# EAGLE board control (EAGLE 9.6.2)
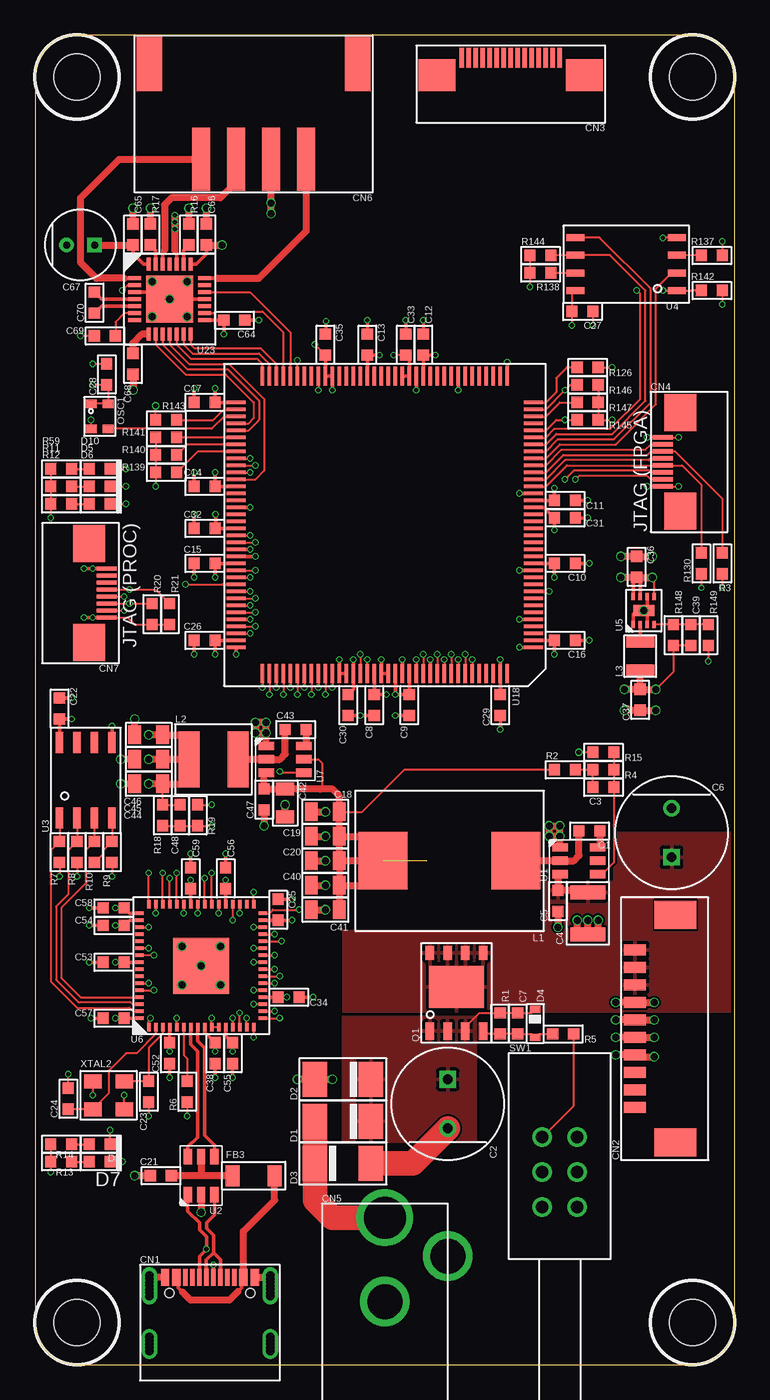
[diagram p5: board, top side]
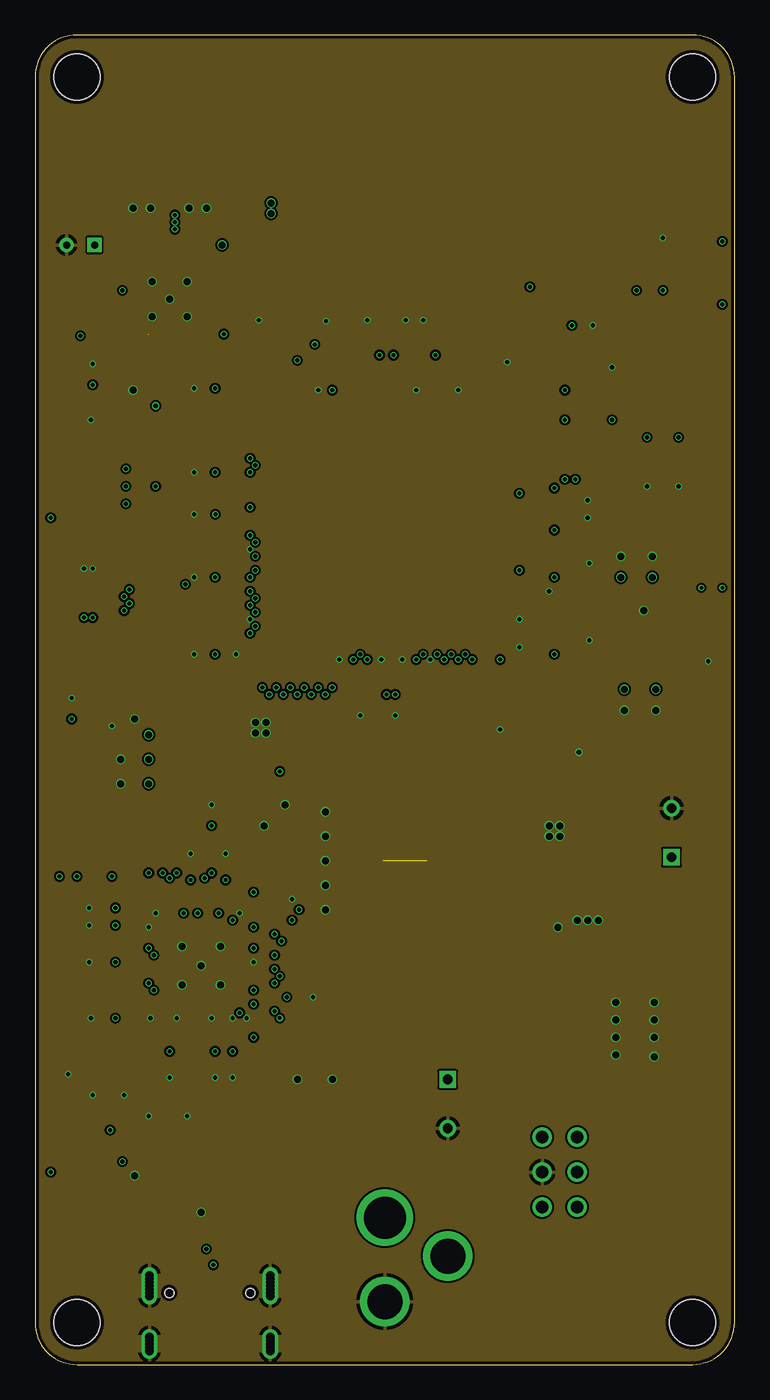
[diagram p6: board, inner layer GND]
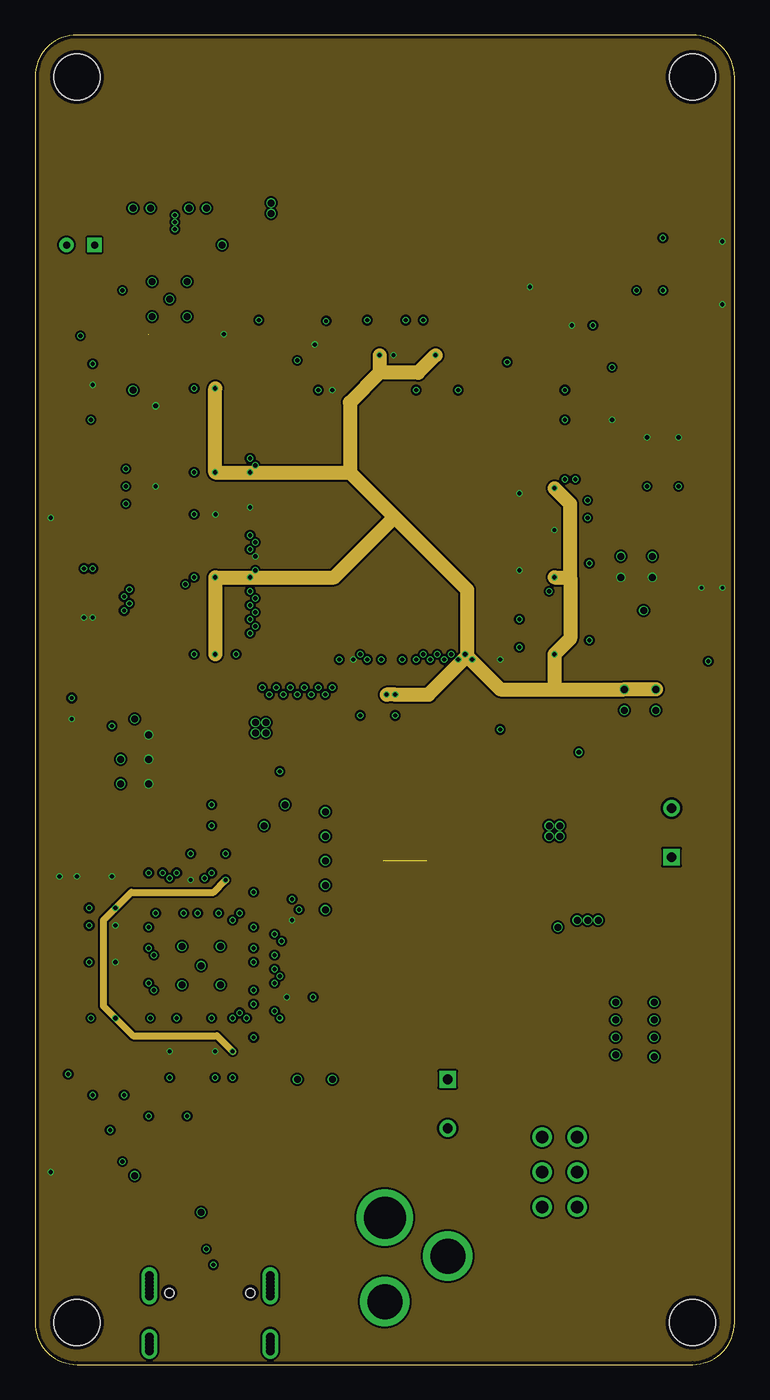
[diagram p7: board, inner layer PWR]
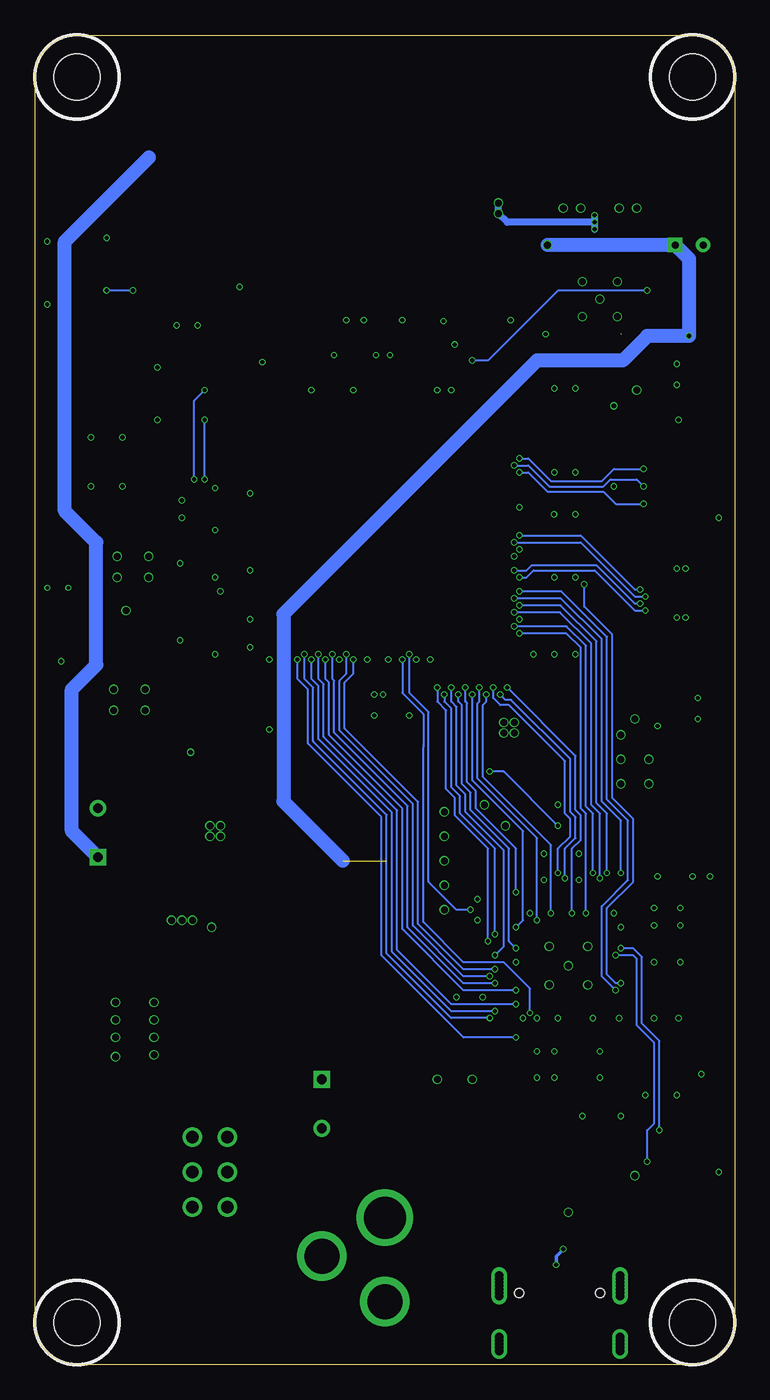
[diagram p8: board, bottom side, seen from below]

Size 50 x 95 mm. Coordinates in mm from the lower left corner, seen from the top.
Outline: 0,92 0,3 arc90 3,0 47,0 arc90 50,3 50,92 arc90 47,95 3,95 arc90 0,92
Copper layers (1*2*3*16): Top 0.035mm / dielectric 0.15mm / GND 0.035mm / dielectric 1.11mm / PWR 0.035mm / dielectric 0.2mm / Bottom 0.035mm
Design rules "myDRC 4 layers 0.15mm": minimum track width 0.15mm, minimum drill 0.25mm, track to track 0.15mm, track to pad 0.15mm, pad to pad 0.15mm, via to via 0.15mm, smd to smd 0mil, copper to edge 0.25mm, drill to drill 0.25mm, minimum pad ring 10mil, minimum via ring 3mil, stop-mask expansion 4mil, vias tented up to drill 1mm, thermal gap 10mil

## Footprints (pad centres in the part's own frame; a part is rotated, then mirrored left to right if it is on the bottom)
0603 = smd 0.8 x 0.8: 1 -0.75,0; 2 0.75,0
8MM_RADIAL_3.5MM_PITCH = drill 0.7: N 1.75,0 | drill 0.7 square: P -1.75,0
1210 = smd 1 x 2.5: 1 -1.5,0; 2 1.5,0
0805 = smd 0.9 x 1.3: 1 -1,0; 2 1,0
5MM_RADIAL_2MM_PITCH = drill 0.5 square: 1 -1,0 | drill 0.5: 2 1,0
MC-107D = smd 0.3 x 1.2: A5 -1.25,3.225; A6 -0.25,3.225; A7 0.25,3.225; A8 1.25,3.225; B5 1.75,3.225; B6 0.75,3.225; B7 -0.75,3.225; B8 -1.75,3.225 | smd 0.6 x 1.2: A9B4 2.4,3.225; A12B1 3.2,3.225; B9A4 -2.4,3.225; B12A1 -3.2,3.225 | drill 0.6 pad 1: P$1 -4.32,2.625; P$2 -4.32,2.875; P$3 -4.32,3.125; P$4 -4.32,3.375; P$5 -4.32,2.375; P$6 -4.32,2.125; P$7 -4.32,1.875; P$8 4.32,2.625; P$9 4.32,2.875; P$10 4.32,3.125; P$11 4.32,3.375; P$12 4.32,2.375; P$13 4.32,2.125; P$14 4.32,1.875; P$15 -4.32,-1.525; P$16 -4.32,-1.275; P$17 -4.32,-1.025; P$18 -4.32,-1.775; P$19 -4.32,-2.025; P$20 4.32,-1.525; P$21 4.32,-1.275; P$22 4.32,-1.025; P$23 4.32,-1.775; P$24 4.32,-2.025 | hole 0.65: -2.9,2.125; 2.9,2.125
1.25-10PWT = smd 0.8 x 1.6: 1 -5.625,2.125; 2 -4.375,2.125; 3 -3.125,2.125; 4 -1.875,2.125; 5 -0.625,2.125; 6 0.625,2.125; 7 1.875,2.125; 8 3.125,2.125; 9 4.375,2.125; 10 5.625,2.125 | smd 2 x 3: PAD1 -8.125,-0.775; PAD2 8.125,-0.775
SFV15R-1STE1HLF = smd 0.3 x 1.4: 1 -3.5,-1.875; 2 -3,-1.875; 3 -2.5,-1.875; 4 -2,-1.875; 5 -1.5,-1.875; 6 -1,-1.875; 7 -0.5,-1.875; 8 0,-1.875; 9 0.5,-1.875; 10 1,-1.875; 11 1.5,-1.875; 12 2,-1.875; 13 2.5,-1.875; 14 3,-1.875; 15 3.5,-1.875 | smd 2.65 x 2.3: SH1 -5.275,-0.625; SH2 5.275,-0.625
SFV8R-1STBE1HLF = smd 0.3 x 1.4: 1 -1.75,-1.875; 2 -1.25,-1.875; 3 -0.75,-1.875; 4 -0.25,-1.875; 5 0.25,-1.875; 6 0.75,-1.875; 7 1.25,-1.875; 8 1.75,-1.875 | smd 2.65 x 2.3: SH1 -3.525,-0.625; SH2 3.525,-0.625
NEB-21-R = drill 3: 1 0,6.5 | drill 2.5: 2 4.5,3.75; 3 0,0.5
S4B-XH-SM4-TB = smd 1.3 x 4.5: 1 3.75,-3.25; 2 1.25,-3.25; 3 -1.25,-3.25; 4 -3.75,-3.25 | smd 1.8 x 3.9: P$1 -7.45,3.55; P$2 7.45,3.55
DO214AC = smd 1.75 x 2.5: A -2,0; K 2,0
SOD_523 = smd 0.5 x 0.75: A -1,0; K 1,0
0603_POLAR = smd 0.8 x 0.8: A 0.75,0; K -0.75,0
1206 = smd 1 x 1.5: 1 1.5,0; 2 -1.5,0
SRP1035A = smd 3.5 x 4.1: 1 -4.75,0; 2 4.75,0
SRN5040 = smd 4 x 1.5: 1 0,1.75; 2 0,-1.75
1008 = smd 0.8 x 2: 1 1,0; 2 -1,0
MOUNTHOLE_6X3 = hole 3.3: 0,0
KC2016Z = smd 0.6 x 0.8: 1 -0.9,-0.6; 2 0.9,-0.6; 3 0.9,0.6; 4 -0.9,0.6
SO8_POWERPAK = smd 1.25 x 0.6: 1 -2.67,1.905; 2 -2.67,0.635; 3 -2.67,-0.635; 4 -2.67,-1.905 | smd 1 x 0.6: 5 2.92,0.635; 6 2.92,-0.635; 7 2.92,-1.905; 8 2.92,1.905 | smd 3 x 3.9: PAD 0.5,0
PBH2UEESNPNAGX = drill 0.9: 1 -1.25,-2.5; 2 -1.25,0; 3 -1.25,2.5; 4 1.25,-2.5; 5 1.25,0; 6 1.25,2.5
SOT23-6 = smd 0.6 x 1.1: 1 0.95,1.35; 2 0,1.35; 3 -0.95,1.35; 4 -0.95,-1.35; 5 0,-1.35; 6 0.95,-1.35
SO8 = smd 1.5 x 0.55: 1 -2.7,1.875; 2 -2.7,0.625; 3 -2.7,-0.625; 4 -2.7,-1.875; 5 2.7,-1.875; 6 2.7,-0.625; 7 2.7,0.625; 8 2.7,1.875
SO8-208MIL = smd 1.3 x 0.5: 1 -3.625,1.905; 2 -3.625,0.635; 3 -3.625,-0.635; 4 -3.625,-1.905; 5 3.625,-1.905; 6 3.625,-0.635; 7 3.625,0.635; 8 3.625,1.905
WSON8 = smd 0.5 x 0.25: 1 -1,0.75; 2 -1,0.25; 3 -1,-0.25; 4 -1,-0.75; 5 1,-0.75; 6 1,-0.25; 7 1,0.25; 8 1,0.75 | smd 0.8 x 1.5: PAD 0,0
QFN64 = smd 0.6 x 0.25: 1 -4.4,3.75; 2 -4.4,3.25; 3 -4.4,2.75; 4 -4.4,2.25; 5 -4.4,1.75; 6 -4.4,1.25; 7 -4.4,0.75; 8 -4.4,0.25; 9 -4.4,-0.25; 10 -4.4,-0.75; 11 -4.4,-1.25; 12 -4.4,-1.75; 13 -4.4,-2.25; 14 -4.4,-2.75; 15 -4.4,-3.25; 16 -4.4,-3.75; 33 4.4,-3.75; 34 4.4,-3.25; 35 4.4,-2.75; 36 4.4,-2.25; 37 4.4,-1.75; 38 4.4,-1.25; 39 4.4,-0.75; 40 4.4,-0.25; 41 4.4,0.25; 42 4.4,0.75; 43 4.4,1.25; 44 4.4,1.75; 45 4.4,2.25; 46 4.4,2.75; 47 4.4,3.25; 48 4.4,3.75 | smd 0.25 x 0.6: 17 -3.75,-4.4; 18 -3.25,-4.4; 19 -2.75,-4.4; 20 -2.25,-4.4; 21 -1.75,-4.4; 22 -1.25,-4.4; 23 -0.75,-4.4; 24 -0.25,-4.4; 25 0.25,-4.4; 26 0.75,-4.4; 27 1.25,-4.4; 28 1.75,-4.4; 29 2.25,-4.4; 30 2.75,-4.4; 31 3.25,-4.4; 32 3.75,-4.4; 49 3.75,4.4; 50 3.25,4.4; 51 2.75,4.4; 52 2.25,4.4; 53 1.75,4.4; 54 1.25,4.4; 55 0.75,4.4; 56 0.25,4.4; 57 -0.25,4.4; 58 -0.75,4.4; 59 -1.25,4.4; 60 -1.75,4.4; 61 -2.25,4.4; 62 -2.75,4.4; 63 -3.25,4.4; 64 -3.75,4.4 | smd 4 x 4: PAD 0,0
QFP144 = smd 1.35 x 0.25: 1 -10.625,8.75; 2 -10.625,8.25; 3 -10.625,7.75; 4 -10.625,7.25; 5 -10.625,6.75; 6 -10.625,6.25; 7 -10.625,5.75; 8 -10.625,5.25; 9 -10.625,4.75; 10 -10.625,4.25; 11 -10.625,3.75; 12 -10.625,3.25; 13 -10.625,2.75; 14 -10.625,2.25; 15 -10.625,1.75; 16 -10.625,1.25; 17 -10.625,0.75; 18 -10.625,0.25; 19 -10.625,-0.25; 20 -10.625,-0.75; 21 -10.625,-1.25; 22 -10.625,-1.75; 23 -10.625,-2.25; 24 -10.625,-2.75; 25 -10.625,-3.25; 26 -10.625,-3.75; 27 -10.625,-4.25; 28 -10.625,-4.75; 29 -10.625,-5.25; 30 -10.625,-5.75; 31 -10.625,-6.25; 32 -10.625,-6.75; 33 -10.625,-7.25; 34 -10.625,-7.75; 35 -10.625,-8.25; 36 -10.625,-8.75; 73 10.625,-8.75; 74 10.625,-8.25; 75 10.625,-7.75; 76 10.625,-7.25; 77 10.625,-6.75; 78 10.625,-6.25; 79 10.625,-5.75; 80 10.625,-5.25; 81 10.625,-4.75; 82 10.625,-4.25; 83 10.625,-3.75; 84 10.625,-3.25; 85 10.625,-2.75; 86 10.625,-2.25; 87 10.625,-1.75; 88 10.625,-1.25; 89 10.625,-0.75; 90 10.625,-0.25; 91 10.625,0.25; 92 10.625,0.75; 93 10.625,1.25; 94 10.625,1.75; 95 10.625,2.25; 96 10.625,2.75; 97 10.625,3.25; 98 10.625,3.75; 99 10.625,4.25; 100 10.625,4.75; 101 10.625,5.25; 102 10.625,5.75; 103 10.625,6.25; 104 10.625,6.75; 105 10.625,7.25; 106 10.625,7.75; 107 10.625,8.25; 108 10.625,8.75 | smd 0.25 x 1.35: 37 -8.75,-10.625; 38 -8.25,-10.625; 39 -7.75,-10.625; 40 -7.25,-10.625; 41 -6.75,-10.625; 42 -6.25,-10.625; 43 -5.75,-10.625; 44 -5.25,-10.625; 45 -4.75,-10.625; 46 -4.25,-10.625; 47 -3.75,-10.625; 48 -3.25,-10.625; 49 -2.75,-10.625; 50 -2.25,-10.625; 51 -1.75,-10.625; 52 -1.25,-10.625; 53 -0.75,-10.625; 54 -0.25,-10.625; 55 0.25,-10.625; 56 0.75,-10.625; 57 1.25,-10.625; 58 1.75,-10.625; 59 2.25,-10.625; 60 2.75,-10.625; 61 3.25,-10.625; 62 3.75,-10.625; 63 4.25,-10.625; 64 4.75,-10.625; 65 5.25,-10.625; 66 5.75,-10.625; 67 6.25,-10.625; 68 6.75,-10.625; 69 7.25,-10.625; 70 7.75,-10.625; 71 8.25,-10.625; 72 8.75,-10.625; 109 8.75,10.625; 110 8.25,10.625; 111 7.75,10.625; 112 7.25,10.625; 113 6.75,10.625; 114 6.25,10.625; 115 5.75,10.625; 116 5.25,10.625; 117 4.75,10.625; 118 4.25,10.625; 119 3.75,10.625; 120 3.25,10.625; 121 2.75,10.625; 122 2.25,10.625; 123 1.75,10.625; 124 1.25,10.625; 125 0.75,10.625; 126 0.25,10.625; 127 -0.25,10.625; 128 -0.75,10.625; 129 -1.25,10.625; 130 -1.75,10.625; 131 -2.25,10.625; 132 -2.75,10.625; 133 -3.25,10.625; 134 -3.75,10.625; 135 -4.25,10.625; 136 -4.75,10.625; 137 -5.25,10.625; 138 -5.75,10.625; 139 -6.25,10.625; 140 -6.75,10.625; 141 -7.25,10.625; 142 -7.75,10.625; 143 -8.25,10.625; 144 -8.75,10.625
QFN28 = smd 0.95 x 0.3: 1 -2.5,1.5; 2 -2.5,1; 3 -2.5,0.5; 4 -2.5,0; 5 -2.5,-0.5; 6 -2.5,-1; 7 -2.5,-1.5; 15 2.5,-1.5; 16 2.5,-1; 17 2.5,-0.5; 18 2.5,0; 19 2.5,0.5; 20 2.5,1; 21 2.5,1.5 | smd 0.3 x 0.95: 8 -1.5,-2.5; 9 -1,-2.5; 10 -0.5,-2.5; 11 0,-2.5; 12 0.5,-2.5; 13 1,-2.5; 14 1.5,-2.5; 22 1.5,2.5; 23 1,2.5; 24 0.5,2.5; 25 0,2.5; 26 -0.5,2.5; 27 -1,2.5; 28 -1.5,2.5 | smd 3.35 x 3.35: 29 0,0
3.2X3.5SMD = smd 1.25 x 1: 1 -1.125,-1; 2 1.125,-1; 3 1.125,1; 4 -1.125,1

## Placement (x,y rotation side)
C1  100nF 16V  [0603]  39.62,38.12 180 top
C2  100uF 50V  [8MM_RADIAL_3.5MM_PITCH]  29.5,18.62 270 top
C3  100pF 50V  [0603]  40.62,41.25 180 top
C4  10uF 50V  [1210]  39.5,32.25 90 top
C5  0.1uF 50V  [0603]  37.38,33.12 90 top
C6  100uF 50V  [8MM_RADIAL_3.5MM_PITCH]  45.5,38 90 top
C7  100pF 50V  [0603]  34.5,24.38 270 top
C8  100nF 16V  [0603]  24.25,47.12 90 top
C9  100nF 16V  [0603]  26.75,47.12 90 top
C10  100nF 16V  [0603]  37.88,57.25 180 top
C11  100nF 16V  [0603]  37.88,61.75 180 top
C12  100nF 16V  [0603]  27.75,72.88 270 top
C13  100nF 16V  [0603]  23.75,72.88 270 top
C14  100nF 16V  [0603]  12.12,62.75 0 top
C15  100nF 16V  [0603]  12.12,57.25 0 top
C16  100nF 16V  [0603]  37.88,51.75 180 top
C17  100nF 16V  [0603]  12.12,68.75 0 top
C18  10uF 50V  [0805]  20.75,39.5 0 top
C19  10uF 50V  [0805]  20.75,37.75 0 top
C20  10uF 50V  [0805]  20.75,36 0 top
C21  0.1uF 16V  [0603]  9,13.5 0 top
C22  0.1uF 16V  [0603]  1.75,46.88 270 top
C23  10pF 100V  [0603]  8.12,19.5 90 top
C24  10pF 100V  [0603]  2.38,19 270 top
C25  0.1uF 16V  [0603]  17.38,32.5 270 top
C26  100nF 16V  [0603]  12.12,51.75 0 top
C27  100nF 16V  [0603]  39.12,75.25 180 top
C28  100nF 16V  [0603]  5.12,70.75 90 top
C29  100nF 16V  [0603]  33.25,47.12 90 top
C30  100nF 16V  [0603]  22.38,47.12 90 top
C31  100nF 16V  [0603]  37.88,60.5 180 top
C32  100nF 16V  [0603]  12.12,59.75 0 top
C33  100nF 16V  [0603]  26.5,72.88 270 top
C34  0.1uF 16V  [0603]  18.12,26.25 180 top
C35  100nF 16V  [0603]  20.75,72.88 270 top
C36  10uF 6.3V  [0603]  43,57 270 top
C37  10uF 6.3V  [0603]  43.25,47.5 90 top
C38  0.1uF 16V  [0603]  12.88,22.25 90 top
C39  33pF 10V  [0603]  46.88,52.12 270 top
C40  10uF 50V  [0805]  20.75,34.25 0 top
C41  10uF 50V  [0805]  20.75,32.5 0 top
C42  10uF 50V  [0805]  17.88,40.12 90 top
C43  100nF 16V  [0603]  18.62,45.38 180 top
C44  10uF 50V  [0805]  8.12,45 0 top
C45  10uF 50V  [0805]  8.12,43.25 0 top
C46  10uF 50V  [0805]  8.12,41.5 0 top
C47  0.1uF 50V  [0603]  16.38,40.38 90 top
C48  NO FIT  [0603]  10.38,39.25 90 top
C52  0.1uF 16V  [0603]  9.62,22.25 90 top
C53  0.1uF 16V  [0603]  5.62,28.75 0 top
C54  0.1uF 16V  [0603]  5.62,31.38 0 top
C55  0.1uF 16V  [0603]  14.12,22.25 90 top
C56  0.1uF 16V  [0603]  13.62,34.75 270 top
C57  0.1uF 16V  [0603]  5.62,24.75 0 top
C58  4.7uF 6.3V  [0603]  5.62,32.62 0 top
C59  0.1uF 16V  [0603]  11.12,34.75 270 top
C64  100nF 16V  [0603]  14.25,74.62 180 top
C65  100nF 16V  [0603]  7,80.75 270 top
C66  100nF 16V  [0603]  12.25,80.75 270 top
C67  100uF 25V  [5MM_RADIAL_2MM_PITCH]  3.25,80 180 top
C68  2.2uF 10V  [0603]  7,71.5 90 top
C69  100nF 16V  [0603]  5,73.5 180 top
C70  0.022uF 50V  [0603]  4.25,75.88 270 top
CN1  USB C 2.0  [MC-107D]  12.5,3 0 top
CN2  JST GH 10 Pin  [1.25-10PWT]  45,24 90 top
CN3  15PIN 0.5MM  [SFV15R-1STE1HLF]  34,91.5 180 top
CN4  8 PIN FFC  [SFV8R-1STBE1HLF]  46.75,64.5 270 top
CN5  NEB-21-R  [NEB-21-R]  25,4 0 top
CN6  S4B-XH-SM4-TB  [S4B-XH-SM4-TB]  15.62,89.38 0 top
CN7  8 PIN FFC  [SFV8R-1STBE1HLF]  3.25,55.12 90 top
D1  B360A-13-F  [DO214AC]  22,17.38 0 top
D2  B360A-13-F  [DO214AC]  22,20.38 0 top
D3  12V BI TVS  [DO214AC]  22,14.38 180 top
D4  BZX585-C10  [SOD_523]  35.75,24.38 90 top
D5  RED LED  [0603_POLAR]  4.62,62.75 180 top
D6  RED LED  [0603_POLAR]  4.62,61.5 180 top
D7  RED LED  [0603_POLAR]  4.62,14.5 180 top
D8  RED LED  [0603_POLAR]  4.62,15.75 180 top
D10  RED LED  [0603_POLAR]  4.62,64 180 top
FB3  150R 100MHz  [1206]  15.62,13.5 0 top
L1  15uH 6.5A  [SRP1035A]  29.62,36 180 top
L2  2.2uH 3.5A  [SRN5040]  12.75,43.25 270 top
L3  1uH  [1008]  43.25,50.62 90 top
MECH1  6mm x 3mm  [MOUNTHOLE_6X3]  3,3 0 top
MECH2  6mm x 3mm  [MOUNTHOLE_6X3]  47,3 180 bottom
MECH3  6mm x 3mm  [MOUNTHOLE_6X3]  3,92 0 top
MECH4  6mm x 3mm  [MOUNTHOLE_6X3]  47,92 0 top
OSC1  33MHz  [KC2016Z]  4.62,67.75 270 top
Q1  GSFP0449  [SO8_POWERPAK]  30.12,26.5 90 top
R1  10k  [0603]  33.25,24.38 270 top
R2  51k  [0603]  37.88,42.5 180 top
R3  10k  [0603]  49.12,57.25 270 top
R4  100k  [0603]  40.62,42.5 180 top
R5  10k  [0603]  37.75,23.62 180 top
R6  12k  [0603]  10.88,19.5 90 top
R7  10k  [0603]  1.75,36.62 270 top
R8  10k  [0603]  3,36.62 270 top
R9  10k  [0603]  5.5,36.62 270 top
R10  2.2k  [0603]  4.25,36.62 90 top
R11  2.2k  [0603]  1.88,62.75 180 top
R12  2.2k  [0603]  1.88,61.5 180 top
R13  2.2k  [0603]  1.88,14.5 180 top
R14  2.2k  [0603]  1.88,15.75 180 top
R15  5.23k  [0603]  40.62,43.75 0 top
R16  0.33R  [0603]  11,80.75 90 top
R17  0.33R  [0603]  8.25,80.75 90 top
R18  34k  [0603]  9.12,39.25 90 top
R19  10k  [0603]  11.62,39.25 270 top
R20  10k  [0603]  8.38,53.62 270 top
R21  10k  [0603]  9.62,53.62 270 top
R59  2.2k  [0603]  1.88,64 180 top
R126  10k  [0603]  39.5,71.25 180 top
R130  10k  [0603]  47.62,57.25 270 top
R137  10k  [0603]  48.38,79.25 0 top
R138  10k  [0603]  36.12,78 180 top
R139  10k  [0603]  9.38,63.75 180 top
R140  10k  [0603]  9.38,65 180 top
R141  10k  [0603]  9.38,66.25 180 top
R142  10k  [0603]  48.38,76.75 0 top
R143  10k  [0603]  9.38,67.5 180 top
R144  10k  [0603]  36.12,79.25 180 top
R145  10k  [0603]  39.5,67.5 0 top
R146  10k  [0603]  39.5,70 0 top
R147  10k  [0603]  39.5,68.75 0 top
R148  180k  [0603]  45.62,52.12 270 top
R149  180k  [0603]  48.12,52.12 90 top
SW1  DPDT  [PBH2UEESNPNAGX]  37.5,13.75 0 top
U1  TPS54302  [SOT23-6]  38.88,36 90 top
U2  USBLC6-2SC6  [SOT23-6]  11.88,13.5 180 top
U3  93LC56B-I/SN  [SO8]  3.62,41.75 90 top
U4  W25Q128JV  [SO8-208MIL]  42.25,78.62 180 top
U5  TPS62065  [WSON8]  43.5,53.88 90 top
U6  FT2232H  [QFN64]  11.88,28.5 90 top
U7  TPS563201  [SOT23-6]  17.88,43.25 90 top
U18  T8Q144C4  [QFP144]  25,60 180 top
U23  TMC2208-LA-T  [QFN28]  9.62,76.12 0 top
XTAL2  12MHz  [3.2X3.5SMD]  5.25,19.25 0 top

## Tracks (layer width: path | path; a pad name or v marks a point on that pad's centre or on a via)
FLS_NHOLD
  Top 0.15: R138.1 38.61,77.98 U4.7
FLS_SPI_CLK
  Top 0.15: U4.6 38.61,79.27 38.5,79.27 | 38.5,79.27 R144.1 | U18.30 36.5,65.75 37.25,66.5 41.25,66.5 43.62,68.88 43.62,76.75 41.1,79.27 38.5,79.27
FLS_SPI_MISO
  Top 0.15: U18.28 36.5,64.75 37.5,65.75 41.5,65.75 44.38,68.62 44.38,76.88 45.49,77.99 U4.2
FLS_SPI_MOSI
  Top 0.15: U18.29 36.5,65.25 37.38,66.12 41.38,66.12 44,68.75 44,76.88 40.34,80.53 U4.5
FLS_SPI_NCS  (via drill 0.3)
  Top 0.15: R142.1 46.88,76.72 46,76.72 | U4.1 46,76.72 | U18.31 36.5,66.25 37.12,66.88 41.12,66.88 43.25,69 43.25,76.49 v42.99,76.74 | v44.88,76.74 45.98,76.74 46,76.72
  Bottom 0.15: v42.99,76.74 v44.88,76.74
FPGA_CLK_33M
  Top 0.15: OSC1.3 5.25,66.88 12.62,66.88 13.5,67.75 U18.75
FPGA_CONF_CBUS_0
  Top 0.15: U18.78 R141.1
FPGA_CONF_CBUS_1
  Top 0.15: U18.79 10.88,65.75 R140.1
FPGA_CONF_CBUS_2
  Top 0.15: U18.80 11.62,65.25 R139.1
FPGA_CONF_CDONE
  Top 0.15: U18.34 36.5,67.75 37.5,68.75 R147.1
FPGA_CONF_CSI  (via drill 0.3)
  Top 0.15: U18.32 36.5,66.75 37.25,67.5 v37.88,67.5 R145.1 | CN4.6 44,63.75 43.88,63.88 38.5,63.88 v37.88,63.25
  Bottom 0.15: v37.88,63.25 v37.88,67.5
FPGA_CONF_NCRST  (via drill 0.3)
  Top 0.15: U18.35 36.5,68.25 v37.88,69.62 38.25,70 R146.1 | CN4.7 44,63.25 43.75,63.5 38.88,63.5 v38.62,63.25
  Bottom 0.15: v38.62,63.25 38.62,68.88 v37.88,69.62
FPGA_CONF_NTEST
  Top 0.15: R143.1 12.74,67.5 13.49,68.25 U18.74
FPGA_JTAG_TCK
  Top 0.15: 45.75,65.25 CN4.3 44,65.25 43.75,65 37.75,65 36.5,63.75 U18.26
  Top 0.152: 45.75,65.25 49.12,61.88 R3.1
FPGA_JTAG_TDI
  Top 0.15: U18.27 36.5,64.25 37.62,65.38 43.62,65.38 44,65.75 CN4.2
FPGA_JTAG_TDO
  Top 0.15: 46.25,64.25 CN4.5 38,64.25 36.5,62.75 U18.24
  Top 0.152: 46.25,64.25 47.62,62.88 R130.1
FPGA_JTAG_TMS
  Top 0.15: U18.25 36.5,63.25 37.88,64.62 43.88,64.62 44,64.75 CN4.4
FPGA_STATUS  (via drill 0.3)
  Top 0.15: U18.83 v15.38,63.75 | D6.K v6.5,61.5
  Bottom 0.15: v15.38,63.75 14.75,63.75 13.38,62.38 9.38,62.38 8.5,61.5 v6.5,61.5
FT_CLKOUT  (via drill 0.3)
  Top 0.15: U6.32 16.75,32.25 17,32.5 v18.88,32.5 | v23.25,50.75 U18.123
  Bottom 0.15: v18.88,32.5 19.88,32.5 21.88,34.5 21.88,46.62 23.25,48 v23.25,50.75
FT_CONT_NCTS  (via drill 0.3)
  Top 0.15: U6.41 v11.62,32.25 | U18.109 v16.25,48.38
  Bottom 0.15: v11.62,32.25 11.62,36.88 11,37.5 11,39.25 11.38,39.62 11.38,43.5 v16.25,48.38
FT_CONT_NDCD  (via drill 0.3)
  Top 0.15: U6.45 v9.62,34.75 | U18.103 v15.75,53.75
  Bottom 0.15: v9.62,34.75 9.62,39.38 10.25,40 10.25,51.53 12.47,53.75 v15.75,53.75
FT_CONT_NDSR  (via drill 0.3)
  Top 0.15: U6.44 v10.12,35.12 | U18.105 v15.75,52.75
  Bottom 0.15: v10.12,35.12 10.12,39.38 10.62,39.88 10.62,51.37 12,52.75 v15.75,52.75
FT_CONT_NDTR  (via drill 0.3)
  Top 0.15: U6.43 v10.62,32.25 | U18.106 v15.38,52.25
  Bottom 0.15: v10.62,32.25 10.62,39.38 11,39.75 11,51.22 12.03,52.25 v15.38,52.25
FT_CONT_NRI  (via drill 0.3)
  Top 0.15: U6.46 v9.12,35.12 | U18.102 v15.38,54.25
  Bottom 0.15: v9.12,35.12 9.12,39.38 9.88,40.12 9.88,51.68 12.44,54.25 v15.38,54.25
FT_CONT_NRTS  (via drill 0.3)
  Top 0.15: U6.40 v12.12,34.75 | U18.110 v16.75,47.88
  Bottom 0.15: v12.12,34.75 12.12,36.88 11.38,37.62 11.38,39.12 11.75,39.5 11.75,43.28 15.97,47.5 16.38,47.5 v16.75,47.88
FT_CONT_NRXLED  (via drill 0.3)
  Top 0.15: D8.K v5.38,16.75 | v8.12,29.75 U6.54
  Bottom 0.15: v5.38,16.75 5.38,23.12 6.62,24.38 6.62,29.12 7.25,29.75 v8.12,29.75
FT_CONT_NTXLED  (via drill 0.3)
  Top 0.15: D7.K v6.25,14.5 | v8.5,29.25 U6.55
  Bottom 0.15: v6.25,14.5 6.25,16.75 5.75,17.25 5.75,23 7,24.25 7,29 7.25,29.25 v8.5,29.25
FT_CONT_PWRSAV  (via drill 0.3)
  Top 0.15: U6.59 v8.12,27.25 | v10.75,55.75 13.38,55.75 13.47,55.75 U18.99
  Bottom 0.15: v8.12,27.25 8.5,27.25 9.12,27.88 9.12,32.62 7.25,34.5 7.25,39 8.75,40.5 8.75,52.15 10.75,54.15 v10.75,55.75
FT_CONT_RX  (via drill 0.3)
  Top 0.15: U6.39 v12.62,35.12 | U18.111 v17.25,48.38
  Bottom 0.15: v12.62,35.12 12.62,36.88 11.75,37.75 11.75,39 12.12,39.38 12.12,43.12 16.12,47.12 16.75,47.12 17.25,47.62 v17.25,48.38
FT_CONT_TX  (via drill 0.3)
  Top 0.15: U6.38 v13.12,32.25 | U18.112 v17.75,47.88
  Bottom 0.15: v13.12,32.25 13.12,37.12 18,42 18,47.12 17.75,47.38 v17.75,47.88
FT_CONT_TXDEN  (via drill 0.3)
  Top 0.15: U6.48 v8.12,35.12 | U18.101 v15.75,54.75
  Bottom 0.15: v8.12,35.12 8.12,38.88 9.5,40.25 9.5,51.84 12.41,54.75 v15.75,54.75
FT_D0  (via drill 0.3)
  Top 0.15: U6.16 v15.62,23.38 | v31.25,50.38 U18.139
  Bottom 0.15: v15.62,23.38 19.38,23.38 25.25,29.25 25.25,39.12 30.5,44.38 30.5,48.25 31.25,49 v31.25,50.38
FT_D1  (via drill 0.3)
  Top 0.15: U6.17 17.48,24.75 v17.49,24.76 | v30.75,50.75 U18.138
  Bottom 0.15: v17.49,24.76 20.26,24.76 24.88,29.38 24.88,39.28 30.12,44.53 30.12,48.38 30.75,49 v30.75,50.75
FT_D2  (via drill 0.3)
  Top 0.15: U6.18 v17.12,25.25 | v30.25,50.38 U18.137
  Bottom 0.15: v17.12,25.25 20.25,25.25 24.5,29.5 24.5,39.44 29.75,44.69 29.75,48.5 30.25,49 v30.25,50.38
FT_D3  (via drill 0.3)
  Top 0.15: U6.19 v15.62,25.75 | v29.75,50.75 U18.136
  Bottom 0.15: v15.62,25.75 20.25,25.75 24.12,29.62 24.12,39.59 29.38,44.84 29.38,48.62 29.75,49 v29.75,50.75
FT_D4  (via drill 0.3)
  Top 0.15: U6.21 v15.62,26.75 | v29.25,50.38 U18.135
  Bottom 0.15: v15.62,26.75 19.38,26.75 23.75,31.12 23.75,39.75 29,45 29,48.75 29.25,49 v29.25,50.38
FT_D5  (via drill 0.3)
  Top 0.15: U6.22 v17.12,27.25 | v28.75,50.75 U18.134
  Bottom 0.15: v17.12,27.25 19.38,27.25 23.38,31.25 23.38,39.9 28.62,45.15 28.62,48.88 28.75,49 v28.75,50.75
FT_D6  (via drill 0.3)
  Top 0.15: U6.23 v17.5,27.75 | v27.75,50.75 U18.132
  Bottom 0.15: v17.5,27.75 19.38,27.75 23,31.38 23,40.06 28.25,45.31 28.25,48.88 U18.132 v27.75,50.75
FT_D7  (via drill 0.3)
  Top 0.15: U6.24 v17.12,28.25 | v27.25,50.38 U18.131
  Bottom 0.15: v17.12,28.25 19.38,28.25 22.62,31.5 22.62,40.21 27.88,45.46 27.88,48.75 U18.131 v27.25,50.38
FT_NOE  (via drill 0.3)
  Top 0.15: U6.33 v15.62,33.75 | U18.115 v19.25,48.38
  Bottom 0.15: v15.62,33.75 15.62,36.88 18.5,39.75 18.5,41 19.12,41.62 19.12,47.25 19.25,47.38 v19.25,48.38
FT_NPWREN  (via drill 0.3)
  Top 0.15: U6.60 v8.5,26.75 | U18.100 v15.38,55.25
  Bottom 0.15: v8.5,26.75 9.5,27.75 9.5,32.75 7.62,34.62 7.62,38.88 9.12,40.38 9.12,51.99 12.38,55.25 v15.38,55.25
FT_NRD  (via drill 0.3)
  Top 0.15: U6.28 v17.62,30.25 | U18.119 v21.25,48.38
  Bottom 0.15: v17.62,30.25 17.62,36.88 20,39.25 20,40.5 20.62,41.12 20.62,46.75 21.25,47.38 v21.25,48.38
FT_NRST  (via drill 0.3)
  Top 0.15: U6.14 v14.62,25.12 | U18.124 v23.75,50.38
  Bottom 0.15: v14.62,25.12 14.62,26.88 16.5,28.75 19.38,28.75 22.25,31.62 22.25,44.12 22.25,44.25 22.25,46.5 23.75,48 v23.75,50.38
FT_NRXF  (via drill 0.3)
  Top 0.15: U6.26 v17.12,29.25 | U18.117 v20.25,48.38
  Bottom 0.15: v17.12,29.25 16.5,29.88 16.5,36.75 19.25,39.5 19.25,40.75 19.88,41.38 19.88,47 20.25,47.38 v20.25,48.38
FT_NSIWU  (via drill 0.3)
  Top 0.15: U6.30 v15.62,31.25 | U18.114 v18.75,47.88
  Bottom 0.15: v15.62,31.25 15.12,31.75 15.12,38.12 18.75,41.75 v18.75,47.88
FT_NSUSPEND  (via drill 0.3)
  Top 0.15: U6.36 v14.12,31.75 | U18.113 v18.25,48.38
  Bottom 0.15: v14.12,31.75 14.12,37.62 18.38,41.88 18.38,47.25 18.25,47.38 v18.25,48.38
FT_NTXE  (via drill 0.3)
  Top 0.15: U6.27 v15.62,29.75 | U18.116 v19.75,47.88
  Bottom 0.15: v15.62,29.75 16.12,30.25 16.12,36.88 18.88,39.62 18.88,40.88 19.5,41.5 19.5,47.12 19.75,47.38 v19.75,47.88
FT_NWR  (via drill 0.3)
  Top 0.15: U6.29 v17.12,30.75 | U18.118 v20.75,47.88
  Bottom 0.15: v17.12,30.75 17.12,36.88 19.62,39.38 19.62,40.62 20.25,41.25 20.25,46.88 20.75,47.38 v20.75,47.88
GND  (via drill 0.3, 0.35, 0.5)
  Top 0.15: U18.64 v20.25,69.62 | C27.1 v39.88,74.25 | R126.1 v41.25,71.25 | OSC1.2 4.02,67.47 v4,67.5 | C28.2 v4.12,71.5 | R149.1 v48.12,50.25 | v43.75,62.75 CN4.8 v46,62.75 | U4.4 44.91,80.53 v44.88,80.5 | U6.51 v8.12,31.25 | U6.47 v8.62,32.25 | U6.35 v14.62,32.25 | U6.25 v15.62,28.75 | U6.15 v15.12,24.75 | v14.12,24.75 U6.13 | U6.11 U6.10 v12.62,24.75 | U6.5 v10.12,24.75 | U6.1 8.12,24.62 v8.25,24.75 | R6.1 v10.88,17.75 | XTAL2.4 v4.12,19.25 | XTAL2.2 v6.38,19.25 | C24.1 v2.38,20.75 | C23.1 v8.12,17.75 | R19.1 v12.62,40
  Top 0.152: R15.1 v38.88,43.75
  Top 0.25: U5.6 43.75,54.12 U5.PAD | U5.3 43.75,53.62 U5.PAD | U5.1 42.75,53.62 43,53.88 U5.PAD | U18.37 v33.75,71.62 | U18.50 v27.25,69.62 | U18.44 v30.25,69.62 | C12.1 v27.75,74.62 | C33.1 v26.5,74.62 | C13.1 v23.75,74.62 | C35.1 20.81,73.68 v20.81,74.56 | C17.1 v11.38,69.75 | C14.1 v11.38,63.75 | v11.38,60.75 C32.1 | U18.94 v15.38,58.25 | C15.1 v11.38,56.25 | U18.104 v15.38,53.25 | U18.108 v14.38,50.75 | C26.1 v11.38,50.75 | U18.121 U18.120 v21.75,50.38 | C30.1 v23.25,46.38 C8.1 | C9.1 v25.75,46.38 | U18.129 v26.25,50.38 | v24.75,50.38 U18.126 U18.127 | U18.133 v28.25,50.38 | C29.1 v33.25,45.38 | U18.1 v34.62,51.25 | C16.1 v39.62,51.75 | U18.5 v34.62,53.25 | U18.9 v36.75,55.25 | C10.1 v39.62,57.25 | C31.1 v39.5,60.5 | C11.1 v39.5,61.75 | C58.1 v3.88,32.62 | C54.1 v3.88,31.38 | C38.1 v12.88,20.5 | C52.1 v9.62,20.5 | C34.1 v19.88,26.25 | C25.1 v18.38,33.25 | C59.1 v11.12,36.5 | C56.1 v13.62,36.5 | C55.1 v14.12,20.5 | C57.1 v4,24.75 | C53.1 v3.88,28.75 | C22.1 v2.62,47.62 | U3.5 v5.5,45.62 | U23.18 U23.29 9.12,76.62 U23.3 | C64.1 v16,74.62 | CN7.8 v4.12,56.88 v3.5,56.88
  Top 0.5: v42.12,46.75 C37.1 v44.38,46.75 | v41.88,57.75 C36.1 v44.12,57.75 | C21.1 v7.12,13.5 | U2.2 v11.88,10.88 | v21.25,20.38 D2.A v18.75,20.38 | v44.25,25.88 CN2.7 v41.5,25.88 | v44.25,24.62 CN2.6 v41.5,24.62 | v44.25,23.38 CN2.5 v41.5,23.38 | v44.25,22 42.88,22 CN2.4 v41.5,22.12 | U1.1 37.52,37.73 v37.5,37.75 | v37.5,37.75 v37.5,38.5 v36.75,38.5 v36.75,37.75 v37.5,37.75 | C5.1 v37.38,31.25 | C4.1 v39.5,31.75 | C4.1 40.12,30.75 40.25,30.88 v40.25,31.75 | C4.1 38.88,30.75 38.75,30.88 v38.75,31.75 | C66.1 v12.25,82.62 | R16.2 v11,82.62 | R17.2 v8.25,82.62 | C65.1 v7,82.62 | C68.1 v7,69.62 | CN1.A12B1 16.67,6.23 CN1.P$11 | CN1.B12A1 8.33,6.23 CN1.P$4 | C41.1 v20.75,32.5 | C40.1 v20.75,34.25 | C20.1 v20.75,36 | C19.1 v20.75,37.75 | C18.1 v20.75,39.5 | C47.1 v16.38,38.5 | C42.1 v17.88,40 | U7.1 16.5,44.23 v16.5,45.12 | v16.5,45.12 v16.5,45.88 v15.75,45.88 v15.75,45.12 v16.5,45.12 | C46.1 v6.12,41.5 | C45.1 v6.12,43.25 | C44.1 v7.12,46.12
  Top 1.75: D3.A 27,14.38 C2.N
  other vias: 43.5,53.88 11.88,28.5 10.5,29.88 13.25,29.88 13.25,27.12 10.5,27.12 9.62,76.12 8.38,77.38 10.88,77.38 8.38,74.88 10.88,74.88
  pour GND: 0,0 50,0 50,125 0,125
N$1
  Top 0.15: Q1.4 32.23,23.62 R1.2 C7.2 35.5,23.62 D4.A 36,23.62 R5.2
N$2
  Top 0.5: C1.1 40.38,37.1 U1.6
N$3
  Top 0.25: U5.2 L3.1
N$4
  Top 0.15: U5.4 R148.1 C39.1 R149.2
N$5
  Top 1.75: CN5.1 21.25,10.5 20,11.75 D3.K D1.A
N$6
  Top 0.5: L1.1 U1.2 38.5,36 38.88,36.38 C1.2
N$7
  Top 0.152: C3.2 R4.2 R2.1
N$8
  Top 0.15: U4.3 45.89,79.27 R137.1
N$9
  Top 0.152: R15.2 R4.1 C3.1 41.38,35.88 40.55,35.05 U1.4
N$10
  Top 0.5: C43.1 19.38,44.35 U7.6
N$11
  Top 0.15: SW1.3 38.5,18.5 R5.1
N$12
  Top 0.25: U2.3 12.82,10.7 12.25,10.12 12.25,9.75 12.75,9.25 12.75,8.46 12.75,8.04 12.75,8 | CN1.B6 13.25,6.92 13.25,7.5 12.75,8 | CN1.A6 12.25,6.92 12.25,7.5 12.75,8
N$13  (via drill 0.3)
  Top 0.25: U2.1 10.93,10.95 11.75,10.12 11.75,9.62 12.25,9.12 v12.25,8.25 11.75,7.75 CN1.B7 | CN1.A7 v12.75,7.12
  Bottom 0.25: v12.75,7.12 12.75,7.75 v12.25,8.25
N$14
  Top 0.15: R11.1 D5.A
N$15
  Top 0.15: R12.1 D6.A
N$16
  Top 0.15: R13.1 D7.A
N$17
  Top 0.15: R14.1 D8.A
N$18  (1 unrouted)
  Top 0.25: 8.07,73.62 8,73.62
  Top 0.5: C68.2 7,73 7.62,73.62 8,73.62
N$19
  Top 0.15: Q1.3 30.76,24.13 31.75,25.12 R1.1 C7.1 35.5,25.12 D4.K
  pour Top: 22,24.88 31.5,24.88 31.5,15.88 22,15.88
N$20
  Top 0.5: L2.1 U7.2 17.5,43.25 17.88,43.62 C43.2
N$24
  Top 0.15: U23.6 6.38,75.12 5.75,74.5 C69.1
N$25  (via drill 0.3)
  Top 0.15: R18.1 C48.1 R19.2 v12.62,38.5 | v17.5,42.38 17.57,42.3 U7.4
  Bottom 0.15: v12.62,38.5 16.5,42.38 v17.5,42.38
N$37
  Top 0.25: C70.2 4.75,75.62 U23.5
N$38
  Top 0.25: C70.1 4.75,76.12 U23.4
N$41
  Top 0.25: CN1.B9A4 10.22,6.1 10.22,5.49 10.54,5.17 | 14.5,5.22 14.78,5.49 14.78,6.1 CN1.A9B4
  Top 0.5: 10.54,5.17 11.09,4.62 13.91,4.62 14.5,5.22 | CN1.A9B4 14.9,9.52 17.12,11.75 FB3.1
N$42
  Top 0.15: U6.6 10.62,22.12 10.88,21.88 R6.2
N$43
  Top 0.15: U3.1 R7.1 1.12,36.75 1.12,27.38 3,25.5 6.75,25.5 7,25.25 U6.63
N$44
  Top 0.15: U3.2 R8.1 2.38,36.75 2.38,33.6 1.5,32.72 1.5,27.5 3.12,25.88 6.85,25.88 6.98,25.75 U6.62
N$45
  Top 0.15: U3.3 R10.2 3.62,36.75 3.62,34.38 1.88,32.62 1.88,27.62 3.25,26.25 U6.61
N$46
  Top 0.15: U3.4 R9.1 4.88,36.75 4.88,36.5 R10.1
N$47
  Top 0.25: U23.23 10.62,79.62 R16.1
N$48
  Top 0.25: U23.27 8.62,79.62 R17.1
N$49
  Top 0.15: U6.3 9.12,23.62 8.12,22.62 C23.2 XTAL2.3
N$50
  Top 0.15: U6.2 8.62,23.62 7.25,22.25 6.5,22.25 5.25,21 5.25,19.38 XTAL2.1 C24.2
N$51  (via drill 0.3)
  Top 0.25: U6.49 6.75,32.25 C58.2 v5.75,32.62 | U6.37 C56.2 v13.62,34.62 | U6.12 13.62,23.5 C55.2 v14.12,22.38 | U6.64 C57.2 v5.75,24.75
  PWR 0.5: v13.62,34.62 12.75,33.75 6.88,33.75 v5.75,32.62 4.88,31.75 4.88,25.62 v5.75,24.75 7,23.5 13,23.5 v14.12,22.38
N$113
  Top 0.15: R59.1 D10.A
N$145
  Top 0.15: U18.36 36.5,68.75 37.25,69.5 37.25,70.5 38,71.25 R126.2
PROC_JTAG_TCK  (via drill 0.3)
  Top 0.15: U18.97 v15.75,56.75 | CN7.3 v6.75,54.38 R20.1
  Bottom 0.15: v15.75,56.75 14.88,56.75 14.5,57.12 9.88,57.12 7.12,54.38 v6.75,54.38
PROC_JTAG_TDI  (via drill 0.3)
  Top 0.15: U18.98 v15.38,56.25 | CN7.2 v6.38,53.88
  Bottom 0.15: v15.38,56.25 14.88,56.25 14.38,56.75 10,56.75 7.12,53.88 v6.38,53.88
PROC_JTAG_TDO  (via drill 0.3)
  Top 0.15: U18.92 v15.38,59.25 | CN7.5 v6.75,55.38 8.62,55.38 R21.1
  Bottom 0.15: v15.38,59.25 11,59.25 7.12,55.38 v6.75,55.38
PROC_JTAG_TMS  (via drill 0.3)
  Top 0.15: U18.93 v15.75,58.75 | CN7.4 v6.38,54.88
  Bottom 0.15: v15.75,58.75 11,58.75 7.12,54.88 v6.38,54.88
PROC_SCANNING  (via drill 0.3)
  Top 0.15: U18.81 v15.38,64.75 | D10.K v6.5,64
  Bottom 0.15: v15.38,64.75 14.75,64.75 13.12,63.12 9.5,63.12 8.62,64 v6.5,64
PROC_STATUS  (via drill 0.3)
  Top 0.15: U18.82 v15.75,64.25 | D5.K v6.5,62.75
  Bottom 0.15: v15.75,64.25 14.75,64.25 13.25,62.75 9.38,62.75 8.88,63.25 7,63.25 v6.5,62.75
PWR_FPGA_1V2  (via drill 0.3, 0.5)
  Top 0.15: C39.2 R148.2 45.62,49.5 v44.38,48.25
  Top 0.25: U18.57 C13.2 v24.62,72.12 | U18.49 C12.2 v28.62,72.12 | U18.73 C17.2 v12.88,69.75 | U18.85 C14.2 v12.88,63.75 | v12.88,56.25 C15.2 U18.96 | v12.88,50.75 C26.2 U18.107 | v25.12,47.88 C8.2 U18.125 | U18.130 C9.2 v25.75,47.88 U18.128 | U18.2 C16.2 v37.12,50.75 | U18.13 C10.2 v37.12,56.25 | v37.12,62.62 C11.2 U18.22
  Top 0.5: C37.2 L3.2 | C37.2 v42.12,48.25 | C37.2 v44.38,48.25
  PWR 1: v44.38,48.25 v42.12,48.25 | v24.62,72.12 24.62,70.88 | 24.62,70.88 27.38,70.88 v28.62,72.12 | v25.12,47.88 v25.75,47.88 28.12,47.88 30.88,50.62 | v12.88,50.75 v12.88,56.25 21.38,56.25 25.69,60.56 | v12.88,69.75 v12.88,63.75 22.5,63.75 | v42.12,48.25 33.25,48.25 30.88,50.62 | 22.5,63.75 25.69,60.56 | 25.69,60.56 30.88,55.38 30.88,50.62 | 24.62,70.88 22.5,68.75 22.5,63.75 | v37.12,56.25 38.25,56.25 | 38.25,56.25 38.25,51.88 v37.12,50.75 37.12,48.25 v42.12,48.25 | 38.25,56.25 38.25,61.5 v37.12,62.62
PWR_LED_24V
  Top 0.5: U1.3 37.38,34.9 C5.2 39.38,33.88 C4.2
  Bottom 1: C6.P 47.38,38.12 47.38,48.25 45.62,50 45.62,58.75 47.88,61 47.88,80.25 41.88,86.25
  pour Top: 22,25.25 50,25.25 50,38 41.38,38 41.38,34.5 36.38,34.5 36.38,31 22,31
PWR_SYS_3V3  (via drill 0.25, 0.3, 0.35, 0.5)
  Top 0.15: U4.8 38.36,76.72 38.38,76.7 C27.2 v38.38,74.25 | R141.2 R140.2 R139.2 v8.62,62.75 | R146.2 R147.2 R145.2 v41.25,67.5 | C35.2 20.75,72.14 v20.01,72.88 | 22.44,47.94 C30.2 | v49.12,80.25 R137.2 | R144.2 R138.2 v35.38,77 | R3.2 v49.12,55.5 | R130.2 v47.62,55.5 | U5.5 44.25,56 44,56.25 C36.2 | v43.75,66.25 CN4.1 v46,66.25 | R142.2 v49.12,75.75 | OSC1.1 OSC1.4 5.23,69.9 C28.1 v4.12,70 | R143.2 v8.62,68.5 | R9.2 v5.5,34.88 | R8.2 v3,34.88 | R7.2 v1.75,34.88 | R14.2 R13.2 v1.12,13.75 | R59.2 R11.2 R12.2 v1.12,60.5 | C46.2 R18.2 C48.2 | R21.2 R20.2 7.12,52.88 6.62,53.38 CN7.1
  Top 0.152: C33.2 v25.62,72.12
  Top 0.25: U18.52 U18.51 26.75,71.88 C33.2 | C35.2 U18.63 U18.62 v21.25,69.62 | U18.88 v15.38,61.25 | U18.91 C32.2 12.9,59.78 v12.9,60.75 | U18.95 15.17,57.75 15.58,57.75 v15.75,57.75 | v22.75,50.38 U18.122 22.75,48.25 22.44,47.94 | v33.25,50.38 U18.143 C29.2 | U18.12 34.83,56.75 v34.62,56.75 | U18.21 36.38,61.25 C31.2 v37.12,59.62 | U18.23 v34.62,62.25 | U5.8 42.75,56 C36.2 43.25,56 U5.7 | U6.50 6.75,31.75 C54.2 v5.75,31.38 | U6.56 C53.2 v5.75,28.75 | U6.9 12.12,23.75 C38.2 v12.88,22.38 | U6.4 C52.2 v9.62,22.38 | U6.20 C34.2 v18,26.25 | U6.31 C25.2 v18.38,31.75 | U6.42 C59.2 v11.12,34.62 | U3.8 C22.2 v2.62,46.12 | U23.15 C64.2 v13.5,73.62 | CN7.1 v4.12,53.38 v3.5,53.38
  Top 0.5: v41.88,56.25 C36.2 v44.12,56.25 | L2.2 C45.2 v8.12,43.25 | L2.2 11,44.75 10.75,45 C44.2 v8.12,45 | L2.2 11,41.75 10.75,41.5 C46.2 v8.12,41.5
  pour PWR (rank 6): 0,0 50,0 50,125 0,125
PWR_SYS_12V  (via drill 0.3, 0.5)  (1 unrouted)
  Top 0.15: U7.5 20.25,43.25 20.5,43 20.5,41.25 20.38,41.12 | C69.2 v3.25,73.5
  Top 0.152: R2.2 26.38,42.5 23.38,39.5 C18.2
  Top 0.25: U23.28 7.75,78.62 7,79.38 C65.2 | U23.22 11.5,78.62 12.25,79.38 C66.2
  Top 0.5: L1.2 C20.2 | C20.2 C40.2 | C40.2 C41.2 | C20.2 C19.2 | C19.2 C18.2 21.75,40.62 21.25,41.12 20.38,41.12 C42.2 C47.2 16.38,42.15 U7.3 | C19.2 24.12,37.75 24.88,37 L1.2 | C40.2 24.38,34.25 24.88,34.75 L1.2 | C67.1 C65.2 | C66.2 v13.38,80
  Bottom 1: v13.38,80 C67.1 3.25,79 v3.25,73.5 6.25,73.5 8,71.75 14.12,71.75 32.25,53.62 32.25,40.25 28,36
PWR_USB_VBUS
  Top 0.5: FB3.2 11.88,13.5 | 11.88,13.5 C21.2 | U2.5 11.88,13.5
STP_CLK
  Top 0.15: U23.13 10.62,72.88 11.25,72.25 16,72.25 16.69,71.56 16.75,71.5 U18.71
STP_DIA
  Top 0.15: U23.11 9.62,72.88 11,71.5 13.88,71.5 16.38,69 16.38,63.88 15.75,63.25 U18.84
STP_DIR
  Top 0.15: U23.19 15.38,76.62 18.25,73.75 18.25,71.62 18.25,71.5 U18.68
STP_IDX
  Top 0.15: U23.12 10.12,72.88 11.12,71.88 15.88,71.88 16.25,71.5 U18.72
STP_MS1
  Top 0.15: U23.9 8.62,72.88 10.75,70.75 13.62,70.75 15.62,68.75 15.62,67.62 15.25,67.25 U18.76
STP_MS2
  Top 0.15: U23.10 9.12,72.88 10.88,71.12 13.75,71.12 16,68.88 16,67.5 15.25,66.75 U18.77
STP_MTR_A1  (via drill 0.3, 0.5)
  Top 0.25: 10,79.62 10.12,79.62 U23.24
  Top 0.5: 10,79.62 v10,81.12 v10,81.62 v10,82.12 | v16.88,82.25 v16.88,83 CN6.2 16.88,86.38
  Bottom 0.5: v10,81.12 v10,81.62 | v10,81.62 v10,82.12 | v10,81.62 16.25,81.62 v16.88,82.25 v16.88,83
STP_MTR_A2
  Top 0.25: U23.21 13,77.62
  Top 0.5: 13,77.62 16,77.62 19.38,81 CN6.1
STP_MTR_B1
  Top 0.25: 9.25,79.62 9.12,79.62 U23.26
  Top 0.5: CN6.3 14.38,84.5 13.25,83.38 9.75,83.38 9.25,82.88 9.25,79.62
STP_MTR_B2
  Top 0.25: U23.1 6.38,77.62
  Top 0.5: 6.38,77.62 4.38,77.62 3.25,78.75 3.25,83.38 6,86.12 CN6.4
STP_NEN  (via drill 0.3)
  Top 0.15: U23.2 6.62,77.12 v6.25,76.75 | U18.67 v18.75,71.75
  Bottom 0.15: v6.25,76.75 12.62,76.75 17.62,71.75 v18.75,71.75
STP_STP
  Top 0.15: U23.16 12.75,75.12 12.88,75.25 16.25,75.25 17.75,73.75 U18.69
STP_UART_IO
  Top 0.15: U23.14 11.12,72.88 11.38,72.62 16.12,72.62 17.25,71.5 U18.70
USB_D_N
  Top 0.25: U6.7 11.12,22.88 11.62,22.38 11.62,16.25 10.93,15.55 U2.6
USB_D_P
  Top 0.25: U6.8 11.62,23.12 12.12,22.62 12.12,16.38 12.82,15.67 U2.4

## Text on the board
tPlace: JTAG (PROC) | JTAG (FPGA)